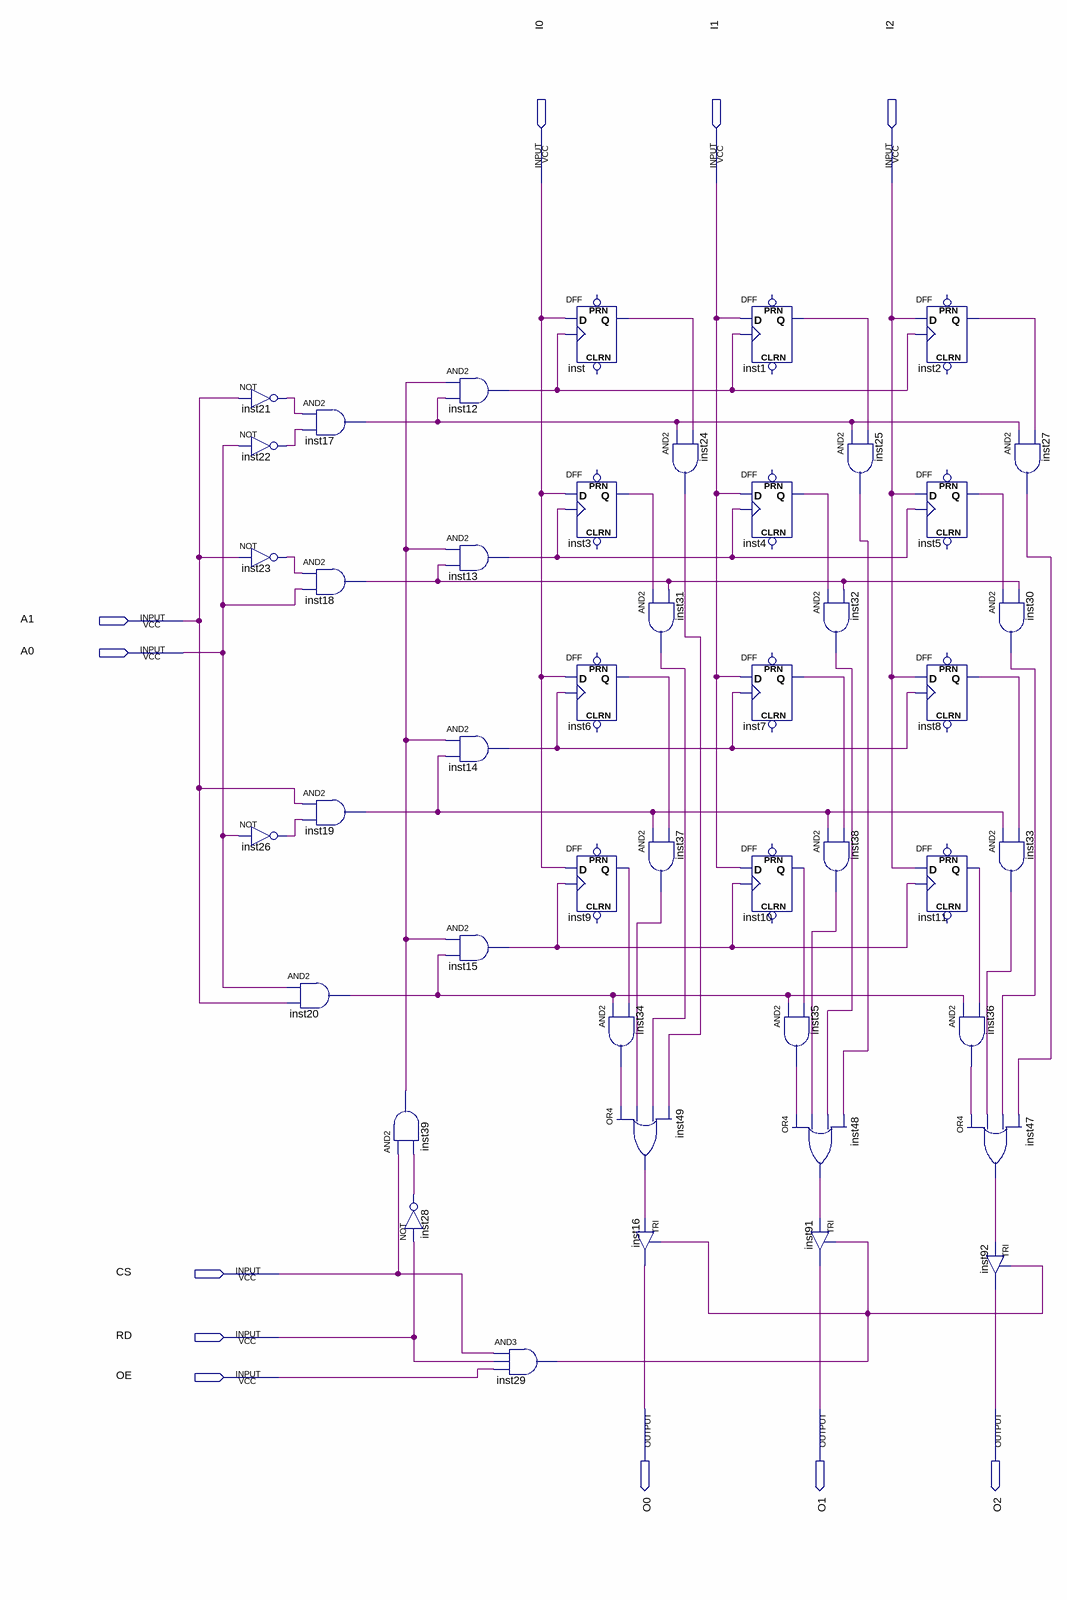
[diagram p0: schematic sheet]
// Quartus schematic memoria.bdf as structural Verilog: 45 symbols, 11 pins
module memoria (
  input  I0,
  input  I1,
  input  I2,
  input  A1,
  input  A0,
  input  CS,
  input  RD,
  input  OE,
  output O0,
  output O1,
  output O2
);

  wire inst1_q, inst2_q, inst3_q, inst4_q, inst5_q, inst6_q, inst7_q, inst8_q, inst9_q, inst10_q, inst11_q,
       inst12_out, inst13_out, inst14_out, inst15_out, inst17_out, inst18_out, inst19_out, inst20_out,
       inst21_out, inst22_out, inst23_out, inst24_out, inst25_out, inst26_out, inst27_out, inst28_out,
       inst29_out, inst30_out, inst31_out, inst32_out, inst33_out, inst34_out, inst35_out, inst36_out,
       inst37_out, inst38_out, inst39_out, inst47_out, inst48_out, inst49_out, inst_q;

  not inst21 (inst21_out, A1);
  not inst22 (inst22_out, A0);
  not inst23 (inst23_out, A1);
  not inst26 (inst26_out, A0);
  and inst20 (inst20_out, A0, A1);
  and inst17 (inst17_out, inst21_out, inst22_out);
  and inst18 (inst18_out, inst23_out, A0);
  and inst19 (inst19_out, A1, inst26_out);
  and inst39 (inst39_out, CS, inst28_out);
  not inst28 (inst28_out, RD);
  and inst12 (inst12_out, inst39_out, inst17_out);
  and inst13 (inst13_out, inst39_out, inst18_out);
  and inst14 (inst14_out, inst39_out, inst19_out);
  and inst15 (inst15_out, inst39_out, inst20_out);
  and inst29 (inst29_out, CS, RD, OE);
  DFF inst (.CLK(inst12_out), .D(I0), .Q(inst_q));  // open: CLRN, PRN
  DFF inst3 (.CLK(inst13_out), .D(I0), .Q(inst3_q));  // open: CLRN, PRN
  DFF inst6 (.CLK(inst14_out), .D(I0), .Q(inst6_q));  // open: CLRN, PRN
  DFF inst9 (.CLK(inst15_out), .D(I0), .Q(inst9_q));  // open: CLRN, PRN
  and inst34 (inst34_out, inst20_out, inst9_q);
  or inst49 (inst49_out, inst34_out, inst37_out, inst31_out, inst24_out);
  and inst24 (inst24_out, inst17_out, inst_q);
  and inst31 (inst31_out, inst3_q, inst18_out);
  and inst37 (inst37_out, inst19_out, inst6_q);
  TRI inst16 (.IN(inst49_out), .OE(inst29_out), .OUT(O0));
  DFF inst1 (.CLK(inst12_out), .D(I1), .Q(inst1_q));  // open: CLRN, PRN
  DFF inst4 (.CLK(inst13_out), .D(I1), .Q(inst4_q));  // open: CLRN, PRN
  DFF inst7 (.CLK(inst14_out), .D(I1), .Q(inst7_q));  // open: CLRN, PRN
  DFF inst10 (.CLK(inst15_out), .D(I1), .Q(inst10_q));  // open: CLRN, PRN
  and inst35 (inst35_out, inst20_out, inst10_q);
  or inst48 (inst48_out, inst35_out, inst38_out, inst32_out, inst25_out);
  TRI inst91 (.IN(inst48_out), .OE(inst29_out), .OUT(O1));
  and inst25 (inst25_out, inst17_out, inst1_q);
  and inst32 (inst32_out, inst4_q, inst18_out);
  and inst38 (inst38_out, inst19_out, inst7_q);
  DFF inst2 (.CLK(inst12_out), .D(I2), .Q(inst2_q));  // open: CLRN, PRN
  DFF inst5 (.CLK(inst13_out), .D(I2), .Q(inst5_q));  // open: CLRN, PRN
  DFF inst8 (.CLK(inst14_out), .D(I2), .Q(inst8_q));  // open: CLRN, PRN
  DFF inst11 (.CLK(inst15_out), .D(I2), .Q(inst11_q));  // open: CLRN, PRN
  and inst30 (inst30_out, inst5_q, inst18_out);
  and inst33 (inst33_out, inst19_out, inst8_q);
  and inst36 (inst36_out, inst20_out, inst11_q);
  or inst47 (inst47_out, inst36_out, inst33_out, inst30_out, inst27_out);
  TRI inst92 (.IN(inst47_out), .OE(inst29_out), .OUT(O2));
  and inst27 (inst27_out, inst17_out, inst2_q);
endmodule
